# EAGLE design iv4_4lw_1.0 (EAGLE 4.16)
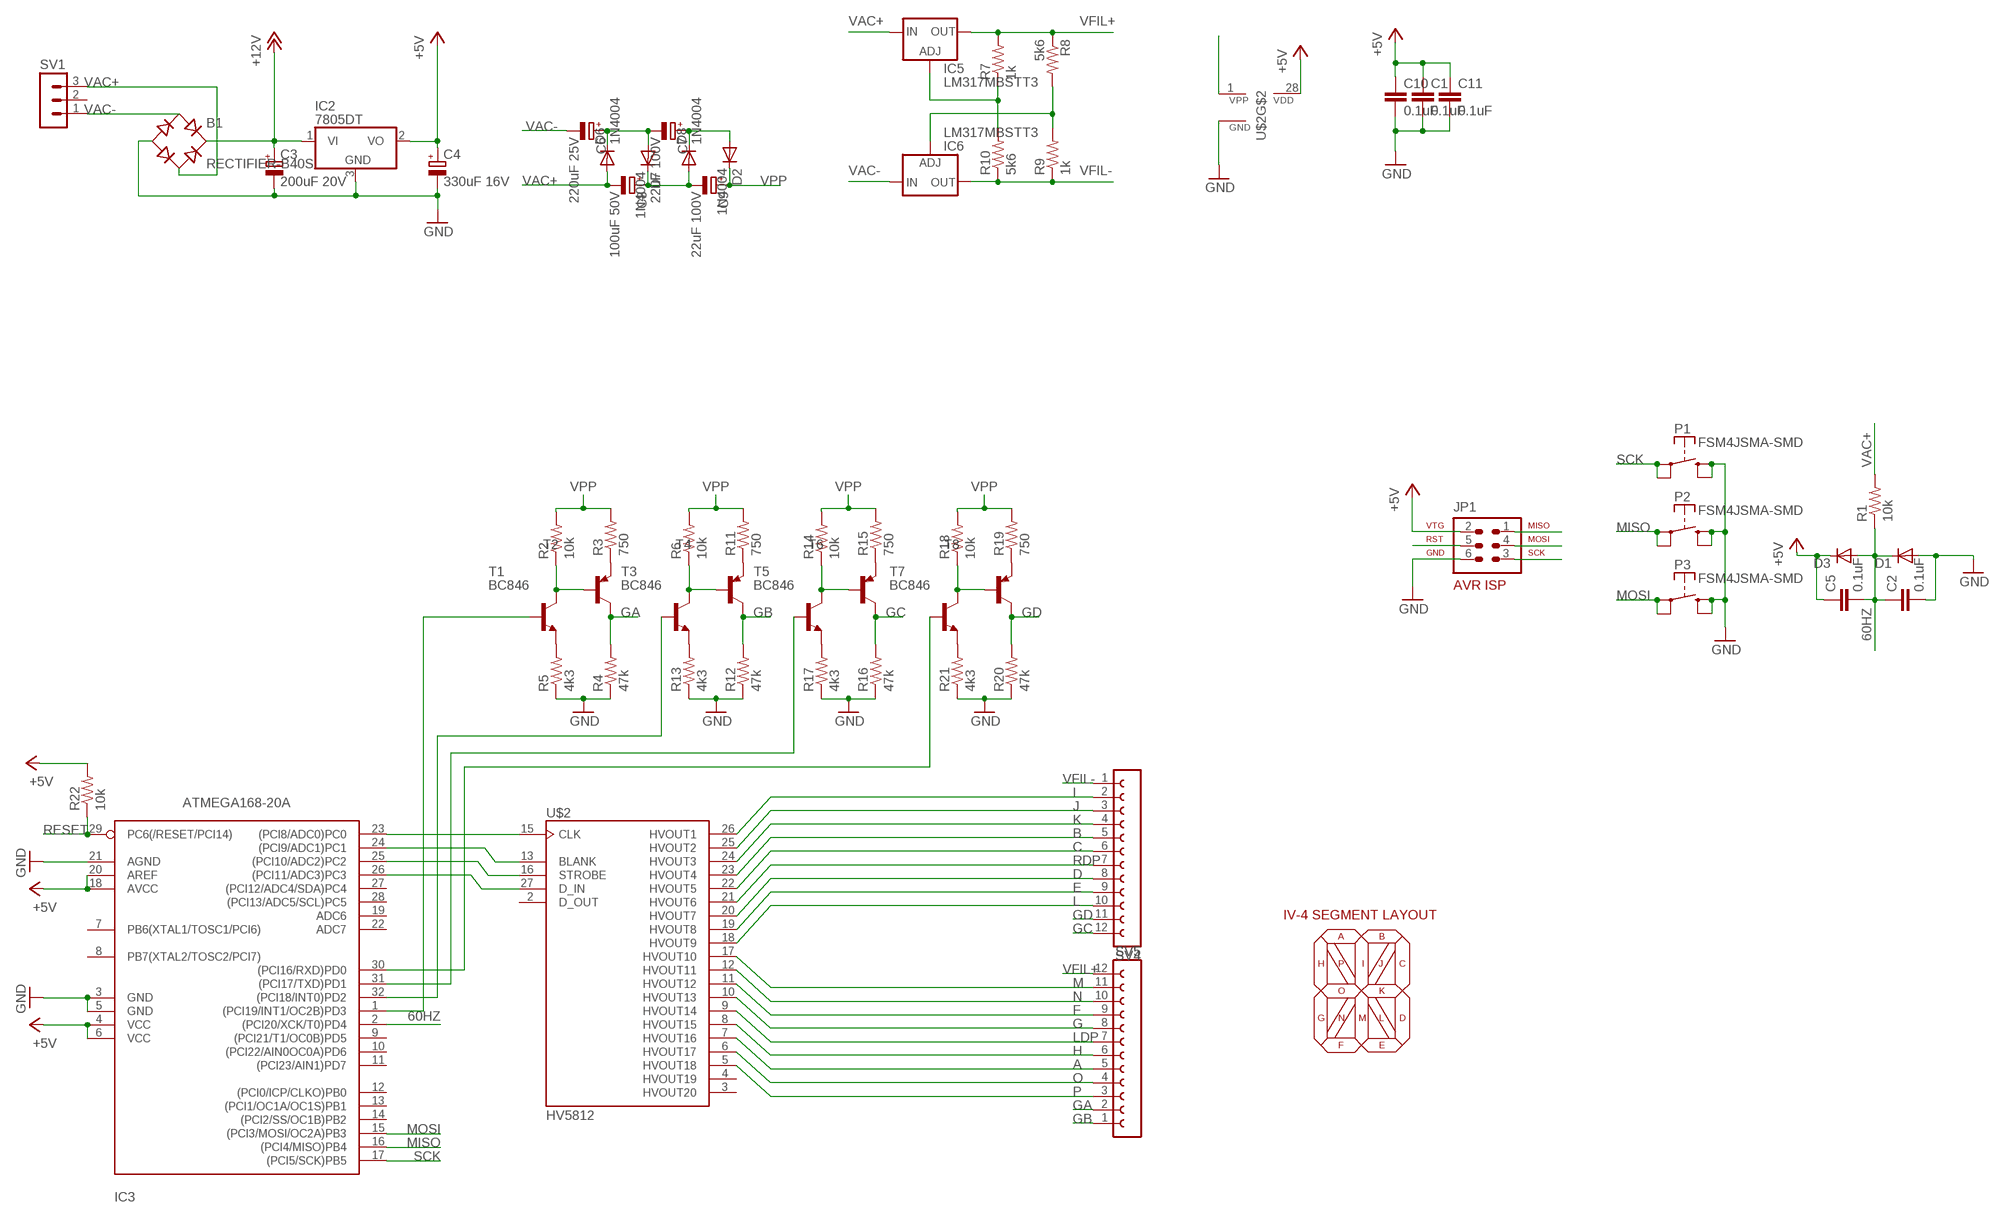
[diagram p0: schematic, sheet 1]

## Parts
B1  RECTIFIER-B40S  [B40S]
C1  0.1uF  C-EUC0805  [C0805]
C2  0.1uF  C-EUC0805  [C0805]
C3  200uF 20V  CPOL-EUE2.5-7  [E2,5-7]
C4  330uF 16V  CPOL-EUE2.5-7  [E2,5-7]
C5  0.1uF  C-EUC0805  [C0805]
C6  220uF 25V  CPOL-EUE2.5-7  [E2,5-7]
C7  22uF 100V  CPOL-EUE2.5-7  [E2,5-7]
C8  100uF 50V  CPOL-EUE2.5-7  [E2,5-7]
C9  22uF 100V  CPOL-EUE2.5-7  [E2,5-7]
C10  0.1uF  C-EUC0805  [C0805]
C11  0.1uF  C-EUC0805  [C0805]
D1  DIODE-SOD123  [SOD123]
D2  1N4004  [DO41-10]
D3  DIODE-SOD123  [SOD123]
D6  1N4004  [DO41-10]
D7  1N4004  [DO41-10]
D8  1N4004  [DO41-10]
IC2  7805DT  [TO252]
IC3  ATMEGA168-20A  [TQFP32-08]
IC5  LM317MBSTT3  [SOT223]
IC6  LM317MBSTT3  [SOT223]
JP1  AVR-ISP-6  [AVR-ISP-6]
P1  FSM4JSMA-SMD  [FSM4JSMA-SMD]
P2  FSM4JSMA-SMD  [FSM4JSMA-SMD]
P3  FSM4JSMA-SMD  [FSM4JSMA-SMD]
R1  10k  R-US_R0805  [R0805]
R2  10k  R-US_R0805  [R0805]
R3  750  R-US_R0805  [R0805]
R4  47k  R-US_R0805  [R0805]
R5  4k3  R-US_R0805  [R0805]
R6  10k  R-US_R0805  [R0805]
R7  1k  R-US_M0805  [M0805]
R8  5k6  R-US_M0805  [M0805]
R9  1k  R-US_M0805  [M0805]
R10  5k6  R-US_M0805  [M0805]
R11  750  R-US_R0805  [R0805]
R12  47k  R-US_R0805  [R0805]
R13  4k3  R-US_R0805  [R0805]
R14  10k  R-US_R0805  [R0805]
R15  750  R-US_R0805  [R0805]
R16  47k  R-US_R0805  [R0805]
R17  4k3  R-US_R0805  [R0805]
R18  10k  R-US_R0805  [R0805]
R19  750  R-US_R0805  [R0805]
R20  47k  R-US_R0805  [R0805]
R21  4k3  R-US_R0805  [R0805]
R22  10k  R-US_R0805  [R0805]
SV1  MA03-1  [MA03-1]
SV4  FE12-1  [FE12]
SV5  FE12-1  [FE12]
T1  BC846  [SOT23]
T2  BC856A-PNP-SOT23-BEC  [SOT23-BEC]
T3  BC846  [SOT23]
T4  BC856A-PNP-SOT23-BEC  [SOT23-BEC]
T5  BC846  [SOT23]
T6  BC856A-PNP-SOT23-BEC  [SOT23-BEC]
T7  BC846  [SOT23]
T8  BC856A-PNP-SOT23-BEC  [SOT23-BEC]
U$2  HV5812  [SO28W]

## Nets
60HZ: C2.1 C5.2 D1.C D3.A IC3.2((PCI20/XCK/T0)PD4) R1.1
+5V: C1.1 C4.+ C5.1 C10.1 C11.1 D3.C IC2.2(VO) IC3.4(VCC) IC3.6(VCC) IC3.18(AVCC) IC3.20(AREF) JP1.2 R22.2 U$2.28(VDD)
+12V: B1.+ C3.+ IC2.1(VI)
A: SV5.5 U$2.7(HVOUT16)
B: SV4.5 U$2.23(HVOUT4)
BLANK: IC3.24((PCI9/ADC1)PC1) U$2.13(BLANK)
C: SV4.6 U$2.22(HVOUT5)
CLK: IC3.23((PCI8/ADC0)PC0) U$2.15(CLK)
D: SV4.8 U$2.20(HVOUT7)
DIN: IC3.26((PCI11/ADC3)PC3) U$2.27(D_IN)
E: SV4.9 U$2.19(HVOUT8)
F: SV5.9 U$2.11(HVOUT12)
G: SV5.8 U$2.10(HVOUT13)
GA: R4.2 SV5.2 T2.C
GB: R12.2 SV5.1 T4.C
GC: R16.2 SV4.12 T6.C
GD: R20.2 SV4.11 T8.C
GND: B1.- C1.2 C2.2 C3.- C4.- C10.2 C11.2 D1.A IC2.3(GND) IC3.3(GND) IC3.5(GND) IC3.21(AGND) JP1.6 P1.P$3(S) P1.P$4(S) P2.P$3(S) P2.P$4(S) P3.P$3(S) P3.P$4(S) R4.1 R5.1 R12.1 R13.1 R16.1 R17.1 R20.1 R21.1 U$2.14(GND)
H: SV5.6 U$2.8(HVOUT15)
I: SV4.2 U$2.26(HVOUT1)
J: SV4.3 U$2.25(HVOUT2)
K: SV4.4 U$2.24(HVOUT3)
L: SV4.10 U$2.18(HVOUT9)
LDP: SV5.7 U$2.9(HVOUT14)
M: SV5.11 U$2.17(HVOUT10)
MISO: IC3.16((PCI4/MISO)PB4) JP1.1 P2.P$1(P) P2.P$2(P)
MOSI: IC3.15((PCI3/MOSI/OC2A)PB3) JP1.4 P3.P$1(P) P3.P$2(P)
N: SV5.10 U$2.12(HVOUT11)
N$2: C7.+ D2.A D8.C
N$4: C6.+ C7.- D6.C D7.A
N$6: R2.1 T1.3(C) T2.B
N$7: R3.1 T2.E
N$8: R5.2 T1.2(E)
N$11: C8.+ C9.- D7.C D8.A
N$12: IC5.1(ADJ) R7.1 R10.2
N$13: IC6.1(ADJ) R8.2 R9.2
N$15: R6.1 T3.3(C) T4.B
N$16: R11.1 T4.E
N$17: R13.2 T3.2(E)
N$19: R14.1 T5.3(C) T6.B
N$20: R15.1 T6.E
N$21: R17.2 T5.2(E)
N$23: R18.1 T7.3(C) T8.B
N$24: R19.1 T8.E
N$25: R21.2 T7.2(E)
N$26: IC3.1((PCI19/INT1/OC2B)PD3) T1.1(B)
N$27: IC3.32((PCI18/INT0)PD2) T3.1(B)
N$28: IC3.31((PCI17/TXD)PD1) T5.1(B)
N$29: IC3.30((PCI16/RXD)PD0) T7.1(B)
O: SV5.4 U$2.6(HVOUT17)
P: SV5.3 U$2.5(HVOUT18)
RDP: SV4.7 U$2.21(HVOUT6)
RESET: IC3.29(PC6(/RESET/PCI14)) JP1.5 R22.1
SCK: IC3.17((PCI5/SCK)PB5) JP1.3 P1.P$1(P) P1.P$2(P)
STROBE: IC3.25((PCI10/ADC2)PC2) U$2.16(STROBE)
VAC+: B1.AC2 C8.- D6.A IC5.3(IN) R1.2 SV1.3
VAC-: B1.AC1 C6.- IC6.3(IN) SV1.1
VFIL+: IC5.4(OUT) R7.2 R8.1 SV5.12
VFIL-: IC6.4(OUT) R9.1 R10.1 SV4.1
VPP: C9.+ D2.C R2.2 R3.2 R6.2 R11.2 R14.2 R15.2 R18.2 R19.2 U$2.1(VPP)
Unconnected: IC3.7(PB6(XTAL1/TOSC1/PCI6)) IC3.8(PB7(XTAL2/TOSC2/PCI7)) IC3.9((PCI21/T1/OC0B)PD5) IC3.10((PCI22/AIN0OC0A)PD6) IC3.11((PCI23/AIN1)PD7) IC3.12((PCI0/ICP/CLKO)PB0) IC3.13((PCI1/OC1A/OC1S)PB1) IC3.14((PCI2/SS/OC1B)PB2) IC3.19(ADC6) IC3.22(ADC7) IC3.27((PCI12/ADC4/SDA)PC4) IC3.28((PCI13/ADC5/SCL)PC5) SV1.2 U$2.2(D_OUT) U$2.3(HVOUT20) U$2.4(HVOUT19)

## Notes on the sheet
- IV-4 SEGMENT LAYOUT
- A | B
- H | P | I | J | C
- O | K
- G | N | M | L | D
- F | E

## Library data of the parts
B1 = rectifier:RECTIFIER-: Rectifier
C1 C2 C5 C10 C11 = rcl:C-EU: CAPACITOR, European symbol
C3 C4 C6-C9 = rcl:CPOL-EU: POLARIZED CAPACITOR, European symbol
D1 D3 = diode:DIODE-: DIODE
D2 D6-D8 = diode-1:1N4004: DIODE general purpose rectifier, 1 A
IC2 = linear:78*: Positive VOLTAGE REGULATOR Source: http://cache.national.com/ds/LM/LM78L05.pdf http://www.fairchildsemi.com/ds/LM/LM7805.pdf
IC3 = avr:ATMEGA168: MICROCONTROLLER 16 kBytes FLASH 1 kBytes SRAM 512 Bytes EEPROM USART 8-channel 10 bit ADC
IC5 IC6 = v-reg:LM317?*: 500 mA Adjustable Output Positive Voltage Regulator Source: http://www.onsemi.co.jp .. LM317M-D.PDF
JP1 = atmel:AVR-ISP-6: AVR ISP-6 Serial Programming Header
P1-P3 = switch-misc:FSM4JSMA-SMD: TYCO SWITCH
R1-R22 = rcl:R-US_: RESISTOR, American symbol
SV1 = con-lstb:MA03-1: PIN HEADER
SV4 SV5 = con-lsta:FE12-1: FEMALE HEADER
T1 T3 T5 T7 = transistor:BC846: NPN TRANSISTOR
T2 T4 T6 T8 = transistor:*-PNP-: PNP Transistror
U$2 = supertex-hv:HV5812

## Board
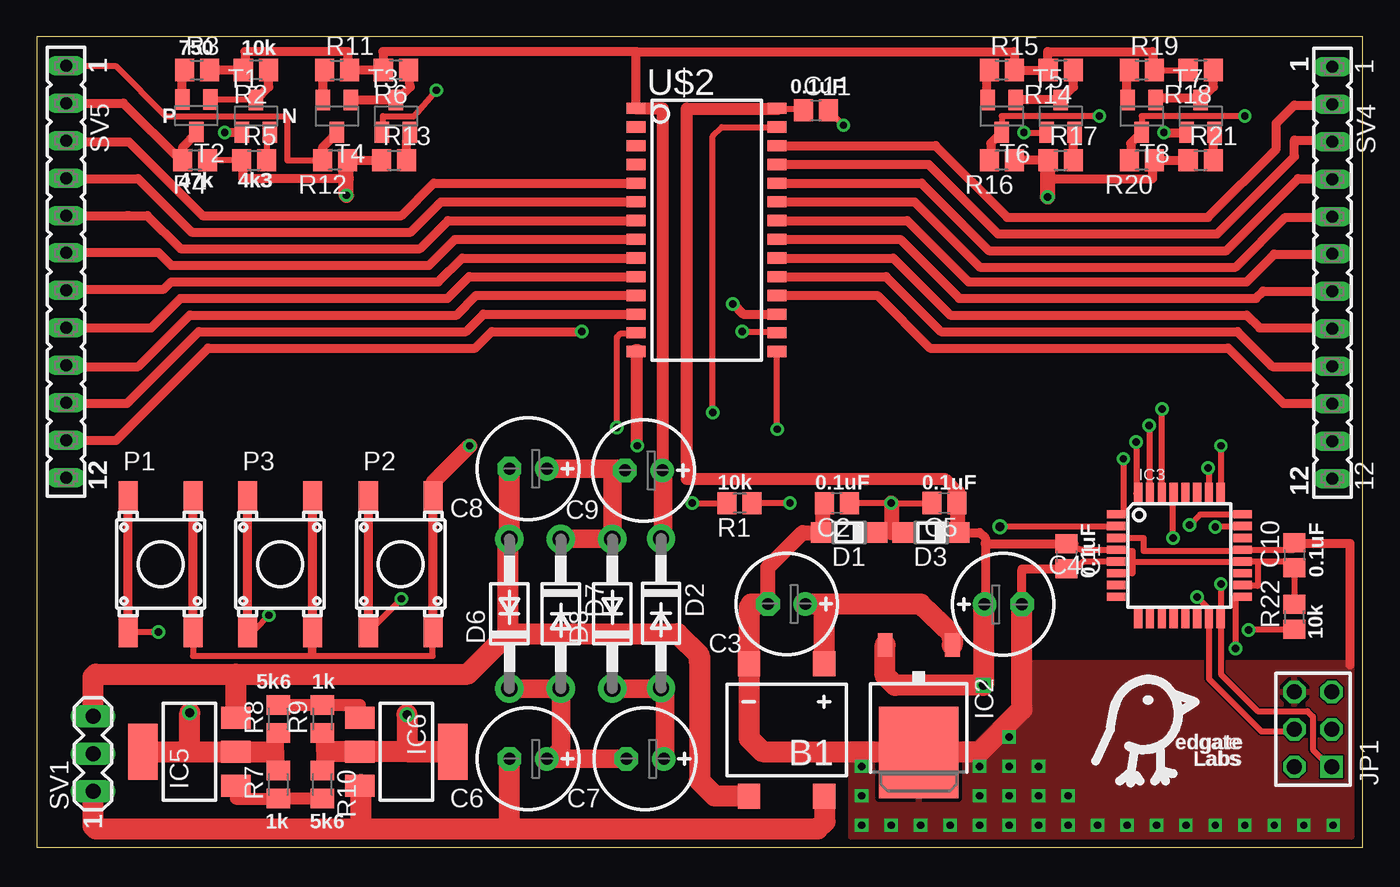
[diagram p1: board, top side]
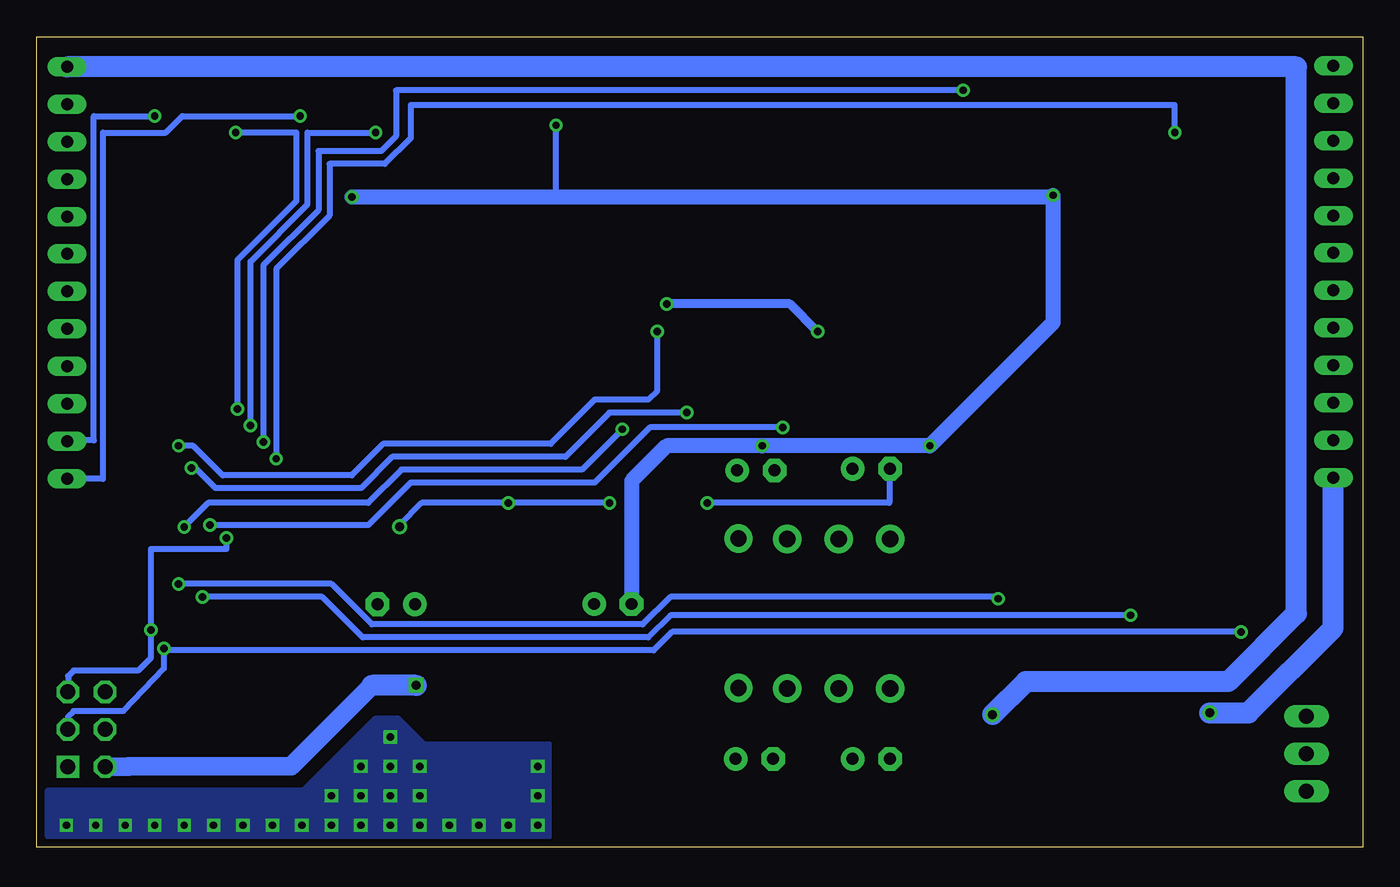
[diagram p2: board, bottom side, seen from below]

Size 90 x 55 mm. Coordinates in mm from the lower left corner, seen from the top.
Outline: 0,0 90,0 90,55 0,55 0,0
Copper layers (1*16): Top 0.0356mm / dielectric 1.5011mm / Bottom 0.0356mm
Design rules "default": minimum track width 10mil, minimum drill 5mil, track to track 5mil, track to pad 5mil, pad to pad 5mil, via to via 5mil, smd to smd 5mil, copper to edge 10mil, drill to drill 8mil, minimum pad ring 10mil, minimum via ring 8mil, stop-mask expansion 4mil, vias tented up to drill 0mil, thermal gap 10mil

### Footprints (pad centres in the part's own frame; a part is rotated, then mirrored left to right if it is on the bottom)
B40S = smd 1.5 x 1.7: + -2.55,-4.5; - 2.55,-4.5; AC1 -2.55,4.5; AC2 2.55,4.5
C0805 = smd 1.3 x 1.5: 1 -0.85,0; 2 0.85,0
E2,5-7 = drill 0.813 pad 1.6 round: + -1.27,0 | drill 0.813 pad 1.6 octagon: - 1.27,0
SOD123 = smd 1.4 x 1.4: A 1.9,0; C -1.9,0
DO41-10 = drill 1.118 pad 1.93 round: A 5.08,0; C -5.08,0
TO252 = smd 1 x 1.6: 1 -2.28,-4.8; 2 2.28,-4.8 | smd 5.4 x 6.2: 3 0,2.5
TQFP32-08 = smd 1.27 x 0.559: 1 -4.293,2.8; 2 -4.293,2; 3 -4.293,1.2; 4 -4.293,0.4; 5 -4.293,-0.4; 6 -4.293,-1.2; 7 -4.293,-2; 8 -4.293,-2.8; 17 4.293,-2.8; 18 4.293,-2; 19 4.293,-1.2; 20 4.293,-0.4; 21 4.293,0.4; 22 4.293,1.2; 23 4.293,2; 24 4.293,2.8 | smd 0.559 x 1.27: 9 -2.8,-4.293; 10 -2,-4.293; 11 -1.2,-4.293; 12 -0.4,-4.293; 13 0.4,-4.293; 14 1.2,-4.293; 15 2,-4.293; 16 2.8,-4.293; 25 2.8,4.293; 26 2,4.293; 27 1.2,4.293; 28 0.4,4.293; 29 -0.4,4.293; 30 -1.2,4.293; 31 -2,4.293; 32 -2.8,4.293
SOT223 = smd 1.5 x 2: 1 -2.3,-3.15; 2 0,-3.15; 3 2.3,-3.15 | smd 3.8 x 2: 4 0,3.15
AVR-ISP-6 = drill 1.016 square: 1 -2.54,-1.27 | drill 1.016 octagon: 2 -2.54,1.27; 3 0,-1.27; 4 0,1.27; 5 2.54,-1.27; 6 2.54,1.27
FSM4JSMA-SMD = smd 1.3 x 2.1: P$1 -2.196,4.584; P$2 -2.196,-4.6; P$3 2.204,4.584; P$4 2.204,-4.6
R0805 = smd 1.3 x 1.5: 1 -0.85,0; 2 0.85,0
M0805 = smd 1.3 x 1.6: 1 -0.95,0; 2 0.95,0
MA03-1 = drill 1.016 long: 1 -2.54,0; 2 0,0; 3 2.54,0
FE12 = drill 0.813 long: 1 -13.97,0; 2 -11.43,0; 3 -8.89,0; 4 -6.35,0; 5 -3.81,0; 6 -1.27,0; 7 1.27,0; 8 3.81,0; 9 6.35,0; 10 8.89,0; 11 11.43,0; 12 13.97,0
SOT23 = smd 1 x 1.4: 1 -0.95,-1.1; 2 0.95,-1.1; 3 0,1.1
SOT23-BEC = smd 1 x 1.4: B -0.95,-1.1; C 0,1.1; E 0.95,-1.1
SO28W = smd 0.762 x 1.27: 1 -8.89,-4.78; 2 -7.62,-4.78; 3 -6.35,-4.78; 4 -5.08,-4.78; 5 -3.81,-4.78; 6 -2.54,-4.78; 7 -1.27,-4.78; 8 0,-4.78; 9 1.27,-4.78; 10 2.54,-4.78; 11 3.81,-4.78; 12 5.08,-4.78; 13 6.35,-4.78; 14 7.62,-4.78; 15 7.62,4.78; 16 6.35,4.78; 17 5.08,4.78; 18 3.81,4.78; 19 2.54,4.78; 20 1.27,4.78; 21 0,4.78; 22 -1.27,4.78; 23 -2.54,4.78; 24 -3.81,4.78; 25 -5.08,4.78; 26 -6.35,4.78; 27 -7.62,4.78; 28 -8.89,4.78

### Placement (x,y rotation side)
B1  50.9,7.97 180 top
C1  69.9,19.76 270 top
C2  54.31,23.36 180 top
C3  50.9,16.52 180 top
C4  65.6,16.5 0 top
C5  61.61,23.37 180 top
C6  33.35,6.01 180 top
C7  41.29,6.01 180 top
C8  33.35,25.69 180 top
C9  41.19,25.58 180 top
C10  85.36,19.83 90 top
C11  52.9,50.01 0 top
D1  55.14,21.36 180 top
D2  42.37,15.88 270 top
D3  60.7,21.36 180 top
D6  32.08,15.85 90 top
D7  35.57,15.85 270 top
D8  39.07,15.85 90 top
IC2  59.87,8.93 180 top
IC3  77.56,19.8 0 top
IC5  10.35,6.49 90 top
IC6  25.09,6.49 270 top
JP1  86.63,8.01 90 top
P1  8.41,19.23 0 top
P2  24.71,19.23 0 top
P3  16.51,19.23 0 top
R1  47.7,23.36 180 top
R2  14.88,52.75 180 top
R3  10.88,52.75 0 top
R4  10.75,46.63 180 top
R5  14.75,46.63 0 top
R6  24.38,52.75 180 top
R7  16.38,4.27 90 top
R8  16.38,8.71 90 top
R9  19.38,8.71 90 top
R10  19.38,4.27 270 top
R11  20.38,52.75 0 top
R12  20.25,46.63 180 top
R13  24.25,46.63 0 top
R14  69.5,52.75 180 top
R15  65.5,52.75 0 top
R16  65.5,46.63 180 top
R17  69.5,46.63 0 top
R18  79,52.75 180 top
R19  75,52.75 0 top
R20  75,46.63 180 top
R21  79,46.63 0 top
R22  85.37,15.65 90 top
SV1  3.81,6.35 90 top
SV4  87.95,39 270 top
SV5  1.98,39.07 270 top
T1  14.88,49.63 0 top
T2  10.83,49.66 180 top
T3  24.38,49.63 0 top
T4  20.38,49.63 180 top
T5  69.5,49.63 0 top
T6  65.5,49.63 180 top
T7  79,49.63 0 top
T8  75,49.63 180 top
U$2  45.46,41.26 270 top

### Tracks (layer width: path | path; a pad name or v marks a point on that pad's centre or on a via)
60HZ  (via drill 0.5, 0.6)
  Top 0.406: 58,23.36 C2.1 | v58,23.38 58,23.36 | 61,23.37 61,23.38 | 61,23.37 C5.2 | 58,23.36 61,23.36 61,23.37 | D3.A D1.C | D3.A 58.88,21.36 58.88,21.38 | D3.A 59,21.36 59,21.38 58,21.38 | IC3.2 65.43,21.8 v65.38,21.75 | R1.1 48.5,23.38 v51.13,23.38
  Top 1.016: v58,23.38 58,21.38
  Bottom 0.406: v51.13,23.38 v58,23.38 63.88,23.38 65.38,21.88 v65.38,21.75
+5V  (via drill 0.6)
  Top 0.406: 62.38,21.25 62.5,21.36 D3.C | 62.5,23.37 C5.1 | 64.38,16.5 C4.+ | 70.5,20.63 C1.1 70.93,20.2 IC3.4 73.3,20.2 73.38,20.13 74.38,20.13 74.38,19.38 | IC3.6 74.35,18.6 74.38,18.63 74.38,19.38 | 82.88,19.4 IC3.20 81.88,19.38 74.38,19.38 | 82.88,19.4 82.88,17.75 81.75,17.75 81.75,17.8 IC3.18 | 82.88,19.4 85.38,19.4 85.38,18.98 | R22.2 85.38,18.98 | 85.38,18.98 C10.1 | C11.1 52,50.01 52,50.13 50.38,50.13
  Top 0.61: D3.C 64.02,21.36 64.38,21 64.38,20.63 | 64.38,16.5 64.37,16.5 C4.+ 64.26,16.5 64.25,16.5 64.38,16.63 64.38,20.63 | C1.1 64.4,20.61 64.38,20.63
  Top 0.813: 62.5,24.13 61.63,25 44.13,25 44.13,50.13 50.24,50.13 | 50.24,50.13 50.38,50.13 | 50.24,50.13 U$2.28
  Top 1.016: 62.5,21.36 62.5,23.37 62.5,24.13
  Top 1.422: IC2.2 57.59,11.67 58.25,11 v64.25,11 64.25,16.5
  Bottom 1.27: JP1.2 83.75,5.49 83.75,5.5 72.75,5.5 67.25,11
  Bottom 1.422: v64.25,11 67.25,11
+12V
  Top 1.422: B1.+ 53.45,16.18 53.13,16.5 52.13,16.5 52.14,16.52 C3.+ 59.99,16.52 62.13,14.5 IC2.1
A
  Top 0.61: U$2.7 27.91,42.53 26,40.63 9.75,40.63 7.5,42.88 6.13,42.88 | 1.88,42.88 SV5.5 6.13,42.88 | 6.13,42.88 6.25,42.88
B
  Top 0.61: U$2.23 59.57,43.8 64,39.38 81.38,39.38 84.75,42.75 87.89,42.75 SV4.5
BLANK  (via drill 0.5)
  Top 0.406: IC3.24 78.98,22.6 v78.25,21.88 | U$2.13 40.67,34.91 40.63,34.88 39.63,34.88 39.38,34.63 v39.38,28.5
  Bottom 0.406: v78.25,21.88 67.5,21.88 64.63,24.75 52.13,24.75 48.38,28.5 v39.38,28.5
C
  Top 0.61: U$2.22 59.1,42.53 63.25,38.38 82.13,38.38 84,40.25 87.94,40.25 SV4.6
CLK  (via drill 0.5)
  Top 0.406: IC3.23 80.05,21.8 v80,21.75 | U$2.15 50.25,33.63 v50.25,28.38
  Bottom 0.406: v80,21.75 78.38,23.38 67.5,23.38 65.25,25.63 53,25.63 v50.25,28.38
D
  Top 0.61: U$2.20 58.14,39.99 62,36.13 82.13,36.13 83,35.25 87.63,35.25 87.75,35.13 87.81,35.19 SV4.8
DIN  (via drill 0.5)
  Top 0.406: IC3.26 79.56,25.69 v79.5,25.75 | v45.88,29.5 45.88,48.25 46.5,48.88 50.13,48.88 50.14,48.88 U$2.27
  Bottom 0.406: v79.5,25.75 79.25,25.75 77.88,24.38 68,24.38 65.88,26.5 54.13,26.5 51.13,29.5 v45.88,29.5
E
  Top 0.61: U$2.19 57.66,38.72 61.38,35 81.5,35 83.88,32.63 87.93,32.63 SV4.9
F
  Top 0.61: SV5.9 1.98,32.73 2,32.75 2.13,32.63 6.88,32.63 10.38,36.13 28.5,36.13 29.83,37.45 U$2.11
G
  Top 0.61: U$2.10 29.35,38.72 27.88,37.25 9.75,37.25 7.75,35.25 2.13,35.25 2.12,35.26 SV5.8
GA
  Top 0.406: SV5.2 | 10.83,48.45 T2.C
  Top 0.61: 10.83,48.45 9.9,47.53 R4.2 9.75,46.63 5.88,50.5 2,50.5 SV5.2
GB
  Top 0.406: SV5.1 5.34,53.04 8.75,49.63 17,49.63 17,46.63 R12.2
  Top 0.61: T4.C 20.38,48.5 19.4,47.53 R12.2
GC  (via drill 0.5)
  Top 0.406: 64.75,46.73 R16.2 | 64.75,46.73 64.75,47.78 | 64.75,46.73 64.73,46.75 | 64.75,47.75 65.5,48.5 65.5,49.63 v72.13,49.63
  Top 0.61: 64.75,47.78 T6.C | 64.75,47.75 64.75,46.73
  Bottom 0.406: v72.13,49.63 80.13,49.63 81.25,48.5 85.5,48.5 85.5,25 87.95,25 SV4.12
GD  (via drill 0.5)
  Top 0.406: 74.25,46.5 R20.2 | 74.25,46.5 74.25,47.78 | 74.25,46.5 74.25,46.63 | 74.25,47.75 75,48.5 75,49.63 v82,49.63
  Top 0.61: 74.25,47.78 T8.C | 74.25,47.75 74.25,46.5
  Bottom 0.406: v82,49.63 86.13,49.63 86.13,27.63 88,27.63 88,27.57 SV4.11
GND  (via drill 0.5)
  Top 0.406: R4.1 R5.1 14,46.53 | C3.- 49.63,16.5 49.63,16.51 C3.- | 49.63,16.63 49.63,16.62 C3.- | 10.63,14.5 10.61,14.52 P1.P$4 10.61,13 18.63,13 18.63,14.63 | 18.63,14.63 18.75,14.63 | 18.75,14.63 18.71,14.67 | 26.91,14.72 26.88,14.75 26.91,14.78 | 18.63,14.63 P3.P$4 | 18.75,14.63 18.75,13 26.88,13 26.88,14.88 26.91,14.88 26.91,14.78 | 26.91,14.78 26.91,14.72 | 26.91,14.72 P2.P$4 | R13.1 23.5,46.38 | 21.13,46.6 R12.1 21,46.63 | 68.63,46.6 R17.1 | 75.75,46.53 R20.1 | D1.A 53.38,21.36 | 53.38,23.36 C2.2 | C1.2 70.53,18.91 71.03,19.4 IC3.5 | 85.38,20.63 85.38,20.2 IC3.21 81.75,20.2 | IC3.3 75.13,21 75.13,20.13 81.75,20.13 81.75,20.2 | 81.75,20.2 81.75,20.25 | C11.2 v54.75,49
  Top 0.61: P1.P$4 P1.P$3 | 18.71,14.67 P3.P$3 | 26.91,14.78 P2.P$3 | R12.1 R13.1 | R17.1 R16.1 | R20.1 R21.1 | 14,46.53 14,45.38 21,45.38 | 75.75,46.53 75.75,45.38 68.63,45.38 | C1.2 67.03,18.91 67,18.88 66.88,18.88 66.87,18.87 C4.- | 89.13,12.38 89.13,20.63 85.38,20.63 85.38,20.68 C10.2
  Top 0.813: v40.75,27.25 40.75,33.64
  Top 1.016: 21,46.63 21,45.38 v21,44.25 | 68.63,46.6 68.63,45.38 v68.63,44.13 | 53.38,21.36 53.38,23.36 | D1.A 51.99,21.36 49.63,19 49.63,16.5 | P2.P$3 26.91,24.78 v29.38,27.25 | 40.75,33.64 U$2.14
  Top 1.422: C3.- 49.61,16.52 49.75,16.5 49.63,16.5 48.5,16.5 48.35,16.28 B1.- 48.35,7.4 49.25,6.5 59.75,6.5 | 59.75,6.5 59.82,6.43 IC2.3 59.79,6.5 59.75,6.5 | C4.- 66.87,9.37 64,6.5 59.75,6.5
  Bottom 0.406: 54.75,44.13 v54.75,49
  Bottom 0.61: v21,44.25 21.13,44.13
  Bottom 1.016: C3.- 49.63,24.88 47.25,27.25 v40.75,27.25 v29.38,27.25 21,35.63 v21,44.25 | 21.13,44.13 54.75,44.13 v68.63,44.13
  other vias: 66,7.5 66,5.5 66,3.5 66,1.5 64,1.5 64,3.5 64,5.5 62,1.5 60,1.5 58,1.5 56,1.5 56,3.5 56,5.5 68,5.5 68,3.5 68,1.5 70,3.5 70,1.5 72,1.5 74,1.5 76,1.5 78,1.5 80,1.5 82,1.5 84,1.5 86,1.5 88,1.5
  pour Top: 55.25,7 55.25,0.75 89.25,0.75 89.25,12.5 67.63,12.5 67.63,10.88 63.75,7
  pour Bottom: 55.25,7 55.25,0.75 89.25,0.75 89.25,3.88 71.88,3.88 67,8.75 65.5,8.75 63.75,7
H
  Top 0.61: U$2.8 28.39,41.26 26.63,39.5 9.13,39.5 8.25,40.38 2,40.38 1.98,40.36 SV5.6
I
  Top 0.61: U$2.26 61.02,47.61 65.88,42.75 79.5,42.75 84.13,47.38 84.13,49.13 85.38,50.38 87.63,50.38 87.75,50.5 87.83,50.43 SV4.2
J
  Top 0.61: U$2.25 60.53,46.34 65.25,41.63 80.13,41.63 85.38,46.88 85.38,48 88,48 88,47.94 SV4.3
K
  Top 0.61: U$2.24 60.06,45.07 64.63,40.5 80.75,40.5 85.63,45.38 87.92,45.38 SV4.4
L
  Top 0.61: U$2.18 57.05,37.45 60.63,33.88 80.88,33.88 84.63,30.13 87.88,30.13 87.89,30.11 SV4.10
LDP
  Top 0.61: U$2.9 28.87,39.99 27.25,38.38 9.13,38.38 8.63,37.88 2.13,37.88 2,37.75 1.98,37.77 SV5.7
M  (via drill 0.5)
  Top 0.406: 1.98,27.61 1.88,27.5 | 1.98,27.61 2,27.63 | SV5.11 1.98,27.61
  Top 0.61: U$2.17 47.95,36.18 v47.25,36.88 | 2,27.63 5.38,27.63 11.63,33.88 29.75,33.88 30.88,35 v37,35
  Bottom 0.61: v47.25,36.88 38.88,36.88 v37,35
MISO  (via drill 0.5)
  Top 0.406: 22.44,23.81 22.38,23.88 | 22.44,23.81 P2.P$1 | 22.51,23.74 22.44,23.81 | JP1.1 87.78,5.47 86.63,6.63 86.63,8.88 86.25,9.25 82.88,9.25 80.38,11.75 80.38,15.38 80.36,15.39 IC3.16 80.38,15.5 v80.38,17.88 | P2.P$2 24.75,16.87 v24.75,16.88
  Top 0.61: P2.P$2 22.51,23.74
  Bottom 0.406: v24.75,16.88 24.75,17 47,17 48.88,15.13 67.25,15.13 70,17.88 v80.38,17.88
MOSI  (via drill 0.5)
  Top 0.406: JP1.4 85.49,8.01 85.5,8 85.38,7.88 83.13,7.88 79.56,11.44 IC3.15 79.51,15.51 79.5,15.5 79.5,16.25 v78.75,17 | 14.31,14.81 14.81,14.81 v15.75,15.75
  Top 0.61: P3.P$2 14.31,14.69 14.25,14.75 14.31,14.81 P3.P$1
  Bottom 0.406: v15.75,15.75 47,15.75 48.5,14.25 67.88,14.25 70.63,17 v78.75,17
N
  Top 0.61: SV5.10 2.05,30.18 2.13,30.25 2.25,30.13 6.13,30.13 11,35 29.13,35 30.31,36.18 U$2.12
N$2
  Top 1.27: 42.5,10.77 42.5,10.8 D2.A 42.63,10.8 42.63,6.01 | 42.5,10.77 D8.C | 42.5,10.77 42.5,10.63 | 42.63,6.01 42.63,6 | C7.+ 42.63,6.01
N$4
  Top 1.27: D6.C D7.A 35.57,6.64 34.94,6.01 | 34.94,6.01 C7.- | C6.+ 34.94,6.01
N$6
  Top 0.406: T1.3 14.78,50.73 14.75,50.76 T2.B | 15.75,52.48 R2.1
  Top 0.61: T1.3 15.75,51.6 15.75,52.48
N$7
  Top 0.406: 9.88,52.6 R3.1
  Top 0.61: T2.E 9.88,52.6
N$8
  Top 0.406: R5.2 15.63,46.88 15.63,48.33 T1.2
N$11
  Top 1.27: 39.07,25.69 C8.+ | 39.07,25.69 D8.A D7.C | C9.- 40,25.58 40,25.63 40,25.69 39.07,25.69
N$12
  Top 0.813: R10.2 R7.1 13.53,3.32 13.53,4.19 IC5.1
N$13
  Top 0.813: R8.2 R9.2 21.92,9.67 21.92,8.79 IC6.1
N$15
  Top 0.406: T3.3 24.35,50.6 | T4.B 21.35,50.48 21.38,50.5 21.28,50.73
  Top 0.61: R6.1 25.35,51.6 24.35,50.6 | 21.28,50.73 T3.3
N$16
  Top 0.406: R11.1 19.5,52.75 19.43,52.68
  Top 0.61: T4.E 19.43,52.68
N$17
  Top 0.406: T3.2 25.2,48.3 25.13,48.38 25.1,47.98
  Top 0.61: R13.2 25.1,47.98
N$19
  Top 0.406: 69.48,50.75 T5.3 | T6.B 66.48,50.75 | 70.38,52.73 R14.1
  Top 0.61: 66.48,50.75 69.48,50.75 | T5.3 70.38,51.6 70.38,52.73
N$20
  Top 0.406: 64.5,52.63 64.53,52.63 R15.1 | T6.E 64.5,50.78
  Top 0.61: 64.5,50.78 64.5,52.63
N$21
  Top 0.406: 70.38,48.45 T5.2 | R17.2 70.38,46.65
  Top 0.61: 70.38,46.65 70.38,48.45
N$23
  Top 0.406: 79,50.88 T7.3 | T8.B 75.98,50.88 | 79.88,52.73 R18.1
  Top 0.61: 75.98,50.88 79,50.88 | T7.3 79.88,51.6 79.88,52.73
N$24
  Top 0.406: 74,52.63 74.03,52.63 R19.1 | T8.E 74,50.9
  Top 0.61: 74,50.9 74,52.63
N$25
  Top 0.406: 79.88,48.58 T7.2 | R21.2 79.88,46.53
  Top 0.61: 79.88,46.53 79.88,48.58
N$26  (via drill 0.5)
  Top 0.406: T1.1 13.93,48.5 | IC3.1 73.73,22.6 73.75,22.63 v73.75,26.38
  Top 0.61: 13.93,48.5 v12.75,48.5
  Bottom 0.406: v12.75,48.5 12.75,50.38 64.63,50.38 64.63,48.13 66.38,46.38 70.13,46.38 70.13,42.88 73.75,39.25 v73.75,26.38
N$27  (via drill 0.5)
  Top 0.406: T3.1 23.5,48.6 23.5,49.63 25.63,49.63 v27.13,51.38 | IC3.32 74.72,24.09 74.63,24 v74.63,27.5
  Bottom 0.406: v27.13,51.38 65.63,51.38 65.63,48.25 66.63,47.25 70.88,47.25 70.88,43.25 74.63,39.5 v74.63,27.5
N$28  (via drill 0.5)
  Top 0.406: 68.53,48.5 arc90 T5.1 68.53,48.53 68.5,48.5 v67,48.5 | IC3.31 75.56,28.57 v75.5,28.63
  Bottom 0.406: v75.5,28.63 75.5,39.75 71.63,43.63 71.63,48.5 v67,48.5
N$29  (via drill 0.5)
  Top 0.406: 78.05,48.5 T7.1 78.03,48.53 78,48.5 | IC3.30 76.36,29.74 v76.38,29.75
  Top 0.61: v76.5,48.5 78,48.5
  Bottom 0.406: v76.38,29.75 76.38,39.88 72.38,43.88 72.38,48.5 v76.5,48.5
O
  Top 0.61: U$2.6 27.43,43.8 25.38,41.75 10.5,41.75 6.88,45.38 2,45.38 1.98,45.4 SV5.4
P
  Top 0.61: SV5.3 1.98,47.98 2,48 2.13,47.88 6.25,47.88 11.25,42.88 24.75,42.88 26.95,45.07 U$2.5
RDP
  Top 0.61: U$2.21 58.61,41.26 62.63,37.25 82.75,37.25 83.25,37.75 87.97,37.75 | 87.97,37.75 88,37.75 | 87.97,37.75 SV4.7
RESET  (via drill 0.5)
  Top 0.406: IC3.29 77.16,23.91 77.13,23.88 v77.13,21 | JP1.5 87.88,10.55 | R22.1 82.25,14.8 v82.25,14.75
  Bottom 0.406: JP1.5 87.88,10.55 87.88,11.63 87.5,12 83.13,12 82.25,12.88 v82.25,14.75 82.25,20.25 77.13,20.25 v77.13,21
SCK  (via drill 0.5)
  Top 0.406: P1.P$1 6.21,23.71 6.13,23.63 6.21,23.54 | 82,17 IC3.17 81.38,17 v81.38,13.5 | 6.13,14.63 P1.P$2 v8.25,14.63
  Top 0.61: P1.P$2 6.21,23.54
  Bottom 0.406: JP1.3 87.9,8.85 87.5,9.25 84.13,9.25 81.38,12.13 v81.38,13.5 81.25,13.38 48.13,13.38 46.88,14.63 v8.25,14.63
STROBE  (via drill 0.5)
  Top 0.406: IC3.25 80.36,27.24 v80.38,27.25 | 50.24,34.89 50.25,34.88 | 50.24,34.89 U$2.16 | v47.88,35 50.13,35 50.24,34.89
  Bottom 0.406: v80.38,27.25 79.38,27.25 77.38,25.25 68.63,25.25 66.5,27.38 55.13,27.38 52.13,30.38 48.5,30.38 47.88,31 v47.88,35
VAC+  (via drill 0.5)
  Top 0.406: 44.97,12.63 45,12.63 | 45,13 45,13.03 44.97,13.03 | R1.2 44.5,23.36 v44.5,23.38
  Top 1.422: SV1.3 3.81,11.56 4,11.75 13.5,11.75 | 32.08,21.17 C8.- | 32.08,21.17 32.25,21 32.18,20.93 D6.A 32.08,21.17 | 13.5,11.75 IC5.3 | 13.5,11.75 29.25,11.75 32,14.5 | 32.08,21.17 32,21.25 32,14.5 | 32,14.5 43.5,14.5 44.97,13.03 44.97,12.63 44.97,4.53 46,3.5 48.25,3.5 48.28,3.47 B1.AC2
  Bottom 0.406: C8.- 32.13,25.69 32.13,23.38 v44.5,23.38
VAC-
  Top 1.422: SV1.1 3.81,1.44 4,1.25 21.5,1.25 | 21.5,1.25 21.75,1.25 22,1.5 22,4.25 IC6.3 | C6.- 32.08,1.33 32,1.25 | 21.5,1.25 32,1.25 | 32,1.25 53,1.25 53.5,1.75 53.5,3.5 53.47,3.47 B1.AC1
VFIL+  (via drill 0.6)
  Top 0.61: IC5.4 10.12,6.49 10.38,6.5
  Top 0.813: 16.39,6.49 R7.2 | 16.39,6.49 R8.1 | 15.75,6.49 16.39,6.49
  Top 1.422: IC5.4 15.75,6.49 | 10.38,6.5 v10.38,9.13
  Bottom 0.61: 1.98,25.02 SV5.12
  Bottom 1.422: v10.38,9.13 7.75,9.13 2,14.88 2,25 1.98,25.02
VFIL-  (via drill 0.6)
  Top 0.813: 19.38,6.49 R10.1 | 19.38,6.49 R9.1 | 20.01,6.49 19.38,6.49
  Top 1.422: 20.01,6.49 IC6.4 25.14,6.49 25.13,6.5 v25.13,9
  Bottom 1.422: v25.13,9 22.88,11.25 9.13,11.25 4.5,15.88 4.5,52.97 SV4.1
VPP
  Top 0.406: 14.13,52.85 R2.2 | 21.38,52.78 R11.2 21.13,52.85 | 78.25,52.75 R18.2 R19.2 75.75,52.75 | R14.2 68.63,52.78 | 30.38,54 31.81,54 | 23.5,52.75 R6.2 | 40.68,54 40.63,54 | 42.5,25.5 42.5,25.63
  Top 0.61: R2.2 R3.2 | R11.2 23.5,52.75 23.5,54 30.38,54 40.63,54 66.35,54 R15.2 R14.2 | 14.13,52.85 14.13,54 21.13,54 21.13,52.85 | 68.63,52.78 68.63,54 75.75,54 75.75,52.75 | U$2.1 40.68,54
  Top 0.813: U$2.1 40.68,50.13 42.5,50.13 42.5,25.63 42.63,25.63
  Top 1.27: C9.+ 42.5,25.58 42.5,25.5 42.5,20.96 D2.C

### Text on the board
tPlace: 750 | 10k | P | N | 47k | 4k3 | edgate | Labs
_tplace: 1 | 750 | 10k | 1 | 0.1uF | P | N | 47k | 4k3 | 12 | 10k | 0.1uF | 0.1uF | 12 | 0.1uF | 0.1uF | 10k | 5k6 | 1k | edgate | Labs | 1 | 1k | 5k6